# Altium schematic sheet Sheet1.SchDoc
size 431 x 279 mm; SheetNumber: 1; SheetTotal: 1; ENG_APP_DATE: --/--/--; DSN_APP_DATE: --/--/--; CHK_APP_DATE: --/--/--
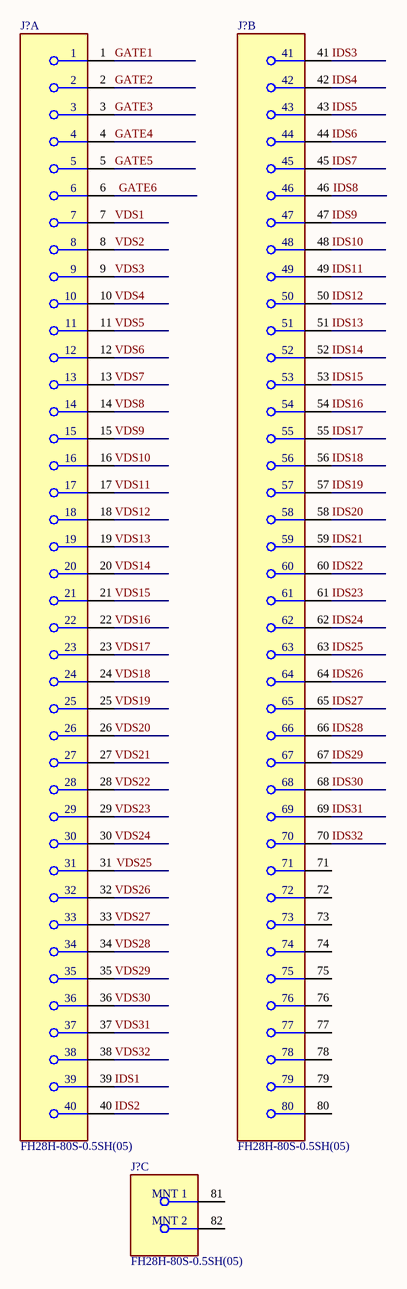
[diagram p0: Sheet1.SchDoc]

## Parts
(Parts that share a designator on the sheet are numbered #1, #2 ... from top to bottom, then left to right.)
J?#1  FH28H-80S-0.5SH(05)  [FP-FH28H-80S-0_5SH_05-MFG]  (part A of 3)
J?#2  FH28H-80S-0.5SH(05)  [FP-FH28H-80S-0_5SH_05-MFG]  (part B of 3)
J?#3  FH28H-80S-0.5SH(05)  [FP-FH28H-80S-0_5SH_05-MFG]  (part C of 3)

## Nets
GATE1: J?#1.1
GATE2: J?#1.2
GATE3: J?#1.3
GATE4: J?#1.4
GATE5: J?#1.5
GATE6: J?#1.6
IDS1: J?#1.39
IDS2: J?#1.40
IDS3: J?#2.41
IDS4: J?#2.42
IDS5: J?#2.43
IDS6: J?#2.44
IDS7: J?#2.45
IDS8: J?#2.46
IDS9: J?#2.47
IDS10: J?#2.48
IDS11: J?#2.49
IDS12: J?#2.50
IDS13: J?#2.51
IDS14: J?#2.52
IDS15: J?#2.53
IDS16: J?#2.54
IDS17: J?#2.55
IDS18: J?#2.56
IDS19: J?#2.57
IDS20: J?#2.58
IDS21: J?#2.59
IDS22: J?#2.60
IDS23: J?#2.61
IDS24: J?#2.62
IDS25: J?#2.63
IDS26: J?#2.64
IDS27: J?#2.65
IDS28: J?#2.66
IDS29: J?#2.67
IDS30: J?#2.68
IDS31: J?#2.69
IDS32: J?#2.70
VDS1: J?#1.7
VDS2: J?#1.8
VDS3: J?#1.9
VDS4: J?#1.10
VDS5: J?#1.11
VDS6: J?#1.12
VDS7: J?#1.13
VDS8: J?#1.14
VDS9: J?#1.15
VDS10: J?#1.16
VDS11: J?#1.17
VDS12: J?#1.18
VDS13: J?#1.19
VDS14: J?#1.20
VDS15: J?#1.21
VDS16: J?#1.22
VDS17: J?#1.23
VDS18: J?#1.24
VDS19: J?#1.25
VDS20: J?#1.26
VDS21: J?#1.27
VDS22: J?#1.28
VDS23: J?#1.29
VDS24: J?#1.30
VDS25: J?#1.31
VDS26: J?#1.32
VDS27: J?#1.33
VDS28: J?#1.34
VDS29: J?#1.35
VDS30: J?#1.36
VDS31: J?#1.37
VDS32: J?#1.38

Not connected (* = marked no-connect by the designer): J?#2 71 72 73 74 75 76 77 78 79 80; J?#3 81(MNT_1) 82(MNT_2)

## Notes on the sheet
- 8
- 7
- 6
- 5
- 4
- 3
- DWG. NO.
- REV.
- SHT.
- 2
- 1
- THIS DOCUMENT AND THE DATA DISCLOSED HEREIN OR HEREWITH IS THE PROPERTY OF ALTIUM LIMITED AND MAY BE FREELY DISTRIBUTED IN WHOLE. NO RIGHTS ARE RESERVED OR EXPRESS OR IMPLIED WARANTEE GIVEN.
- REVISION
- DESCRIPTION
- DATE
- APPROVED
- F
- E
- D
- C
- B
- ENG:
- APPROVALS
- PROJECT
- SUITE 200
- 2175 SALK AVENUE
- CARLSBAD, CA 92008
- A
- DSN:
- CHK:
- REFERENCE DOCUMENTS
- PROJECT REVISION:
- TITLE
- DOCUMENT REVISION:
- DESIGN ITEM:
- USA
- BOM:
- FAB DWG:
- PCB DWG:
- ASSY DWG:
- SCALE:
- SIZE
- CAGE CODE
- FILE NAME
- DWG NO.
- SHEET
- OF
- REV

## Library data of the parts
J?#1-J?#3 = CMP-11609-000031-1: CONN FFC BOTTOM 80POS 0.50MM R/A; Number of Positions: 80; Voltage Rating: 50V; Contact Resistance: 50mR; Max Current Rating: 500mA; Gender: Receptacle; Pitch: 0.5mm; Mating Cycles: 20; Actuator Material: Polymer; Insulation Resistance: 500MR; Contact Plating: Gold; Orientation: Right Angle; Contact Material: Bronze; Number of Rows: 1; Max Operating Temperature: 85°C; Number of Contacts: 80; Flammability Rating: UL94 V-0; Lead Pitch: 0.5mm; Length: 44.9mm; Radiation Hardening: No; Packaging: Tape and Reel; RoHS Compliant: Yes; REACH SVHC: No SVHC; Current Rating: 500mA; Housing Color: Grey; Depth: 6.5mm; Min Operating Temperature: -40°C; Series: FH28; Termination: Solder; Package Quantity: 1; Housing Material: Polymer; Mount: Surface Mount; Max Voltage Rating (AC): 50V